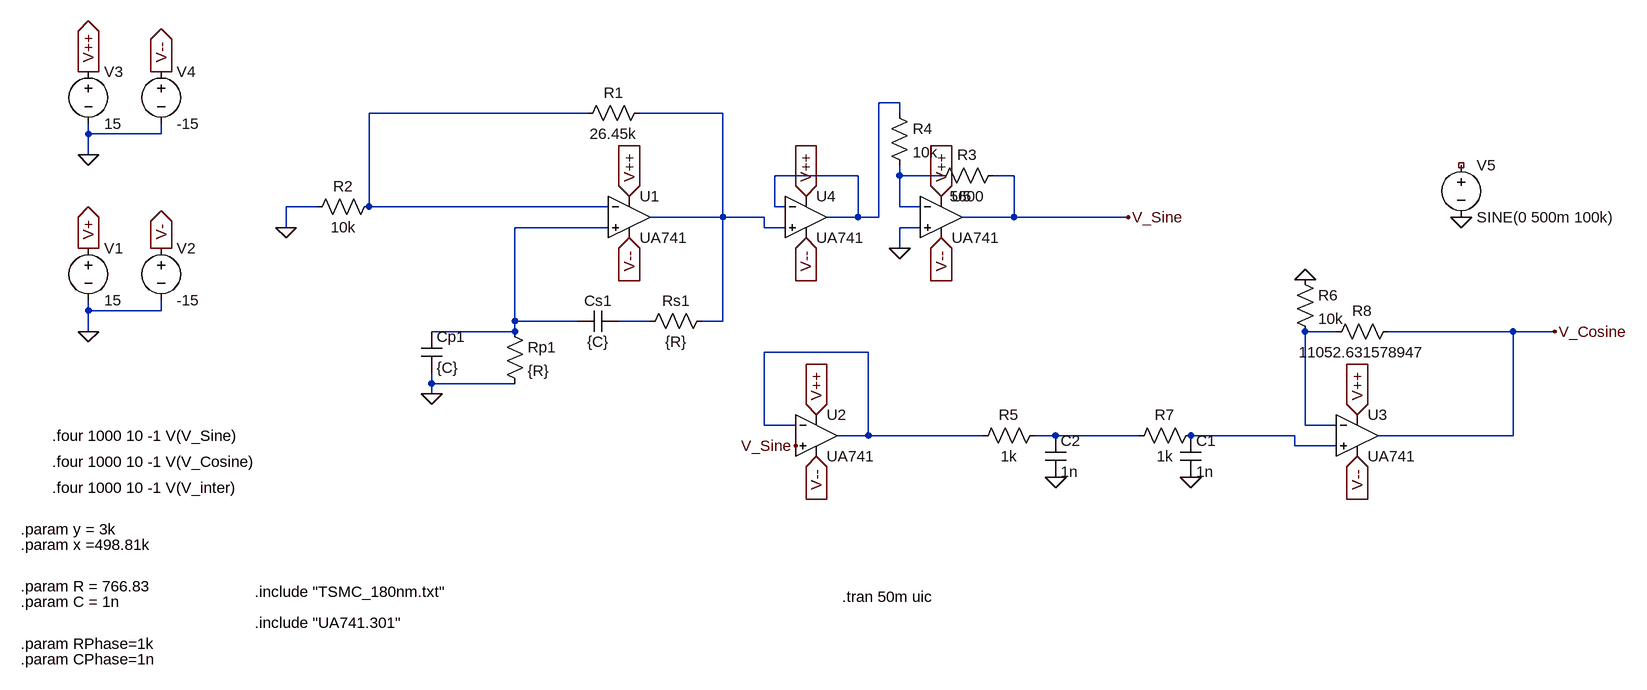
[diagram p0: schematic Draft4.asc]
Draft4.asc, the LTspice schematic file:
Version 4
SHEET 1 1676 872
WIRE 544 0 512 0
WIRE 64 16 -272 16
WIRE 272 16 144 16
WIRE 544 16 544 0
WIRE -704 48 -704 32
WIRE -592 48 -592 32
WIRE -592 48 -704 48
WIRE -704 80 -704 48
WIRE 480 112 352 112
WIRE 544 112 544 96
WIRE 608 112 544 112
WIRE 720 112 688 112
WIRE -352 160 -400 160
WIRE -272 160 -272 16
WIRE 96 160 -272 160
WIRE 352 160 352 112
WIRE 368 160 352 160
WIRE 544 160 544 112
WIRE 576 160 544 160
WIRE 272 176 272 16
WIRE 272 176 160 176
WIRE 336 176 272 176
WIRE 480 176 480 112
WIRE 480 176 432 176
WIRE 512 176 512 0
WIRE 512 176 480 176
WIRE 720 176 720 112
WIRE 720 176 640 176
WIRE 896 176 720 176
WIRE -400 192 -400 160
WIRE 96 192 -48 192
WIRE 336 192 336 176
WIRE 368 192 336 192
WIRE 576 192 544 192
WIRE 544 224 544 192
WIRE -704 320 -704 304
WIRE -592 320 -592 304
WIRE -592 320 -704 320
WIRE -48 336 -48 192
WIRE 48 336 -48 336
WIRE 160 336 112 336
WIRE 272 336 272 176
WIRE 272 336 240 336
WIRE -704 352 -704 320
WIRE -48 352 -48 336
WIRE -48 352 -176 352
WIRE 1216 352 1168 352
WIRE 1488 352 1296 352
WIRE 1552 352 1488 352
WIRE 496 384 336 384
WIRE -176 432 -176 416
WIRE -48 432 -176 432
WIRE -176 448 -176 432
WIRE 336 496 336 384
WIRE 384 496 336 496
WIRE 1168 496 1168 352
WIRE 1216 496 1168 496
WIRE 496 512 496 384
WIRE 496 512 448 512
WIRE 672 512 496 512
WIRE 784 512 752 512
WIRE 912 512 784 512
WIRE 1152 512 992 512
WIRE 1488 512 1488 352
WIRE 1488 512 1280 512
WIRE 1152 528 1152 512
WIRE 1216 528 1152 528
FLAG 128 144 V++
IOPIN 128 144 In
FLAG 128 208 V--
IOPIN 128 208 In
FLAG -176 448 0
FLAG -400 192 0
FLAG 896 176 V_Sine
FLAG -704 352 0
FLAG -704 224 V+
IOPIN -704 224 Out
FLAG -592 224 V-
IOPIN -592 224 Out
FLAG -704 80 0
FLAG -704 -48 V++
IOPIN -704 -48 Out
FLAG -592 -48 V--
IOPIN -592 -48 Out
FLAG 400 144 V++
IOPIN 400 144 In
FLAG 400 208 V--
IOPIN 400 208 In
FLAG 608 144 V++
IOPIN 608 144 In
FLAG 608 208 V--
IOPIN 608 208 In
FLAG 544 224 0
FLAG 416 480 V++
IOPIN 416 480 In
FLAG 416 544 V--
IOPIN 416 544 In
FLAG 384 528 V_Sine
FLAG 992 576 0
FLAG 784 576 0
FLAG 1248 480 V++
IOPIN 1248 480 In
FLAG 1248 544 V--
IOPIN 1248 544 In
FLAG 1168 272 0
FLAG 1552 352 V_Cosine
FLAG 1408 176 0
SYMBOL OpAmps\\opamp2 128 112 R0
SYMATTR InstName U1
SYMATTR Value UA741
SYMBOL cap -192 352 R0
SYMATTR InstName Cp1
SYMATTR Value {C}
SYMBOL cap 112 320 R90
WINDOW 0 0 32 VBottom 2
WINDOW 3 32 32 VTop 2
SYMATTR InstName Cs1
SYMATTR Value {C}
SYMBOL res -64 336 R0
SYMATTR InstName Rp1
SYMATTR Value {R}
SYMBOL res 256 320 R90
WINDOW 0 0 56 VBottom 2
WINDOW 3 32 56 VTop 2
SYMATTR InstName Rs1
SYMATTR Value {R}
SYMBOL res 160 0 R90
WINDOW 0 0 56 VBottom 2
WINDOW 3 32 56 VTop 2
SYMATTR InstName R1
SYMATTR Value 26.45k
SYMBOL res -256 144 R90
WINDOW 0 0 56 VBottom 2
WINDOW 3 32 56 VTop 2
SYMATTR InstName R2
SYMATTR Value 10k
SYMBOL voltage -704 208 R0
WINDOW 123 0 0 Left 0
WINDOW 39 0 0 Left 0
SYMATTR InstName V1
SYMATTR Value 15
SYMBOL voltage -592 208 R0
WINDOW 123 0 0 Left 0
WINDOW 39 0 0 Left 0
SYMATTR InstName V2
SYMATTR Value -15
SYMBOL voltage -704 -64 R0
WINDOW 123 0 0 Left 0
WINDOW 39 0 0 Left 0
SYMATTR InstName V3
SYMATTR Value 15
SYMBOL voltage -592 -64 R0
WINDOW 123 0 0 Left 0
WINDOW 39 0 0 Left 0
SYMATTR InstName V4
SYMATTR Value -15
SYMBOL OpAmps\\opamp2 400 112 R0
SYMATTR InstName U4
SYMATTR Value UA741
SYMBOL OpAmps\\opamp2 608 112 R0
SYMATTR InstName U5
SYMATTR Value UA741
SYMBOL res 704 96 R90
WINDOW 0 0 56 VBottom 2
WINDOW 3 32 56 VTop 2
SYMATTR InstName R3
SYMATTR Value 5600
SYMBOL res 528 0 R0
SYMATTR InstName R4
SYMATTR Value 10k
SYMBOL OpAmps\\opamp2 416 448 R0
SYMATTR InstName U2
SYMATTR Value UA741
SYMBOL res 1008 496 R90
WINDOW 0 0 56 VBottom 2
WINDOW 3 32 56 VTop 2
SYMATTR InstName R7
SYMATTR Value 1k
SYMBOL cap 976 512 R0
SYMATTR InstName C1
SYMATTR Value 1n
SYMBOL res 768 496 R90
WINDOW 0 0 56 VBottom 2
WINDOW 3 32 56 VTop 2
SYMATTR InstName R5
SYMATTR Value 1k
SYMBOL cap 768 512 R0
SYMATTR InstName C2
SYMATTR Value 1n
SYMBOL OpAmps\\opamp2 1248 448 R0
SYMATTR InstName U3
SYMATTR Value UA741
SYMBOL res 1312 336 R90
WINDOW 0 0 56 VBottom 2
WINDOW 3 32 56 VTop 2
SYMATTR InstName R8
SYMATTR Value 11052.631578947
SYMBOL res 1152 256 R0
SYMATTR InstName R6
SYMATTR Value 10k
SYMBOL voltage 1408 80 R0
WINDOW 123 0 0 Left 0
WINDOW 39 0 0 Left 0
SYMATTR InstName V5
SYMATTR Value SINE(0 500m 100k)
TEXT -448 752 Left 2 !.include "TSMC_180nm.txt"
TEXT -448 800 Left 2 !.include "UA741.301"
TEXT 456 760 Left 2 !.tran 50m uic
TEXT -760 512 Left 2 !.four 1000 10 -1 V(V_Sine)
TEXT -760 552 Left 2 !.four 1000 10 -1 V(V_Cosine)
TEXT -760 592 Left 2 !.four 1000 10 -1 V(V_inter)
TEXT -808 656 Left 2 !.param y = 3k
TEXT -808 680 Left 2 !.param x =498.81k
TEXT -808 744 Left 2 !.param R = 766.83
TEXT -808 768 Left 2 !.param C = 1n
TEXT -808 832 Left 2 !.param RPhase=1k
TEXT -808 856 Left 2 !.param CPhase=1n

The netlist it stands for:
* Draft4.asc
XU1 N005 N002 V++ V-- N003 UA741  ; pins In+ In- V+ V- OUT
Cp1 N005 0 {C}
Cs1 N006 N005 {C}
Rp1 N005 0 {R}
Rs1 N003 N006 {R}
R1 N003 N002 26.45k
R2 N002 0 10k
V1 V+ 0 15
V2 V- 0 -15
V3 V++ 0 15
V4 V-- 0 -15
XU4 N003 N001 V++ V-- N001 UA741  ; pins In+ In- V+ V- OUT
XU5 0 N004 V++ V-- V_Sine UA741  ; pins In+ In- V+ V- OUT
R3 V_Sine N004 5600
R4 N001 N004 10k
XU2 V_Sine N008 V++ V-- N008 UA741  ; pins In+ In- V+ V- OUT
R7 N010 N009 1k
C1 N010 0 1n
R5 N009 N008 1k
C2 N009 0 1n
XU3 N010 N007 V++ V-- V_Cosine UA741  ; pins In+ In- V+ V- OUT
R8 V_Cosine N007 11052.631578947
R6 0 N007 10k
V5 NC_01 0 SINE(0 500m 100k)
.include "TSMC_180nm.txt"
.include "UA741.301"
.tran 50m uic
.four 1000 10 -1 V(V_Sine)
.four 1000 10 -1 V(V_Cosine)
.four 1000 10 -1 V(V_inter)
.param y = 3k
.param x =498.81k
.param R = 766.83
.param C = 1n
.param RPhase=1k
.param CPhase=1n
.backanno
.end